# Altium schematic sheet Sheet1.SchDoc
size C; SheetNumber: 1; SheetTotal: 1
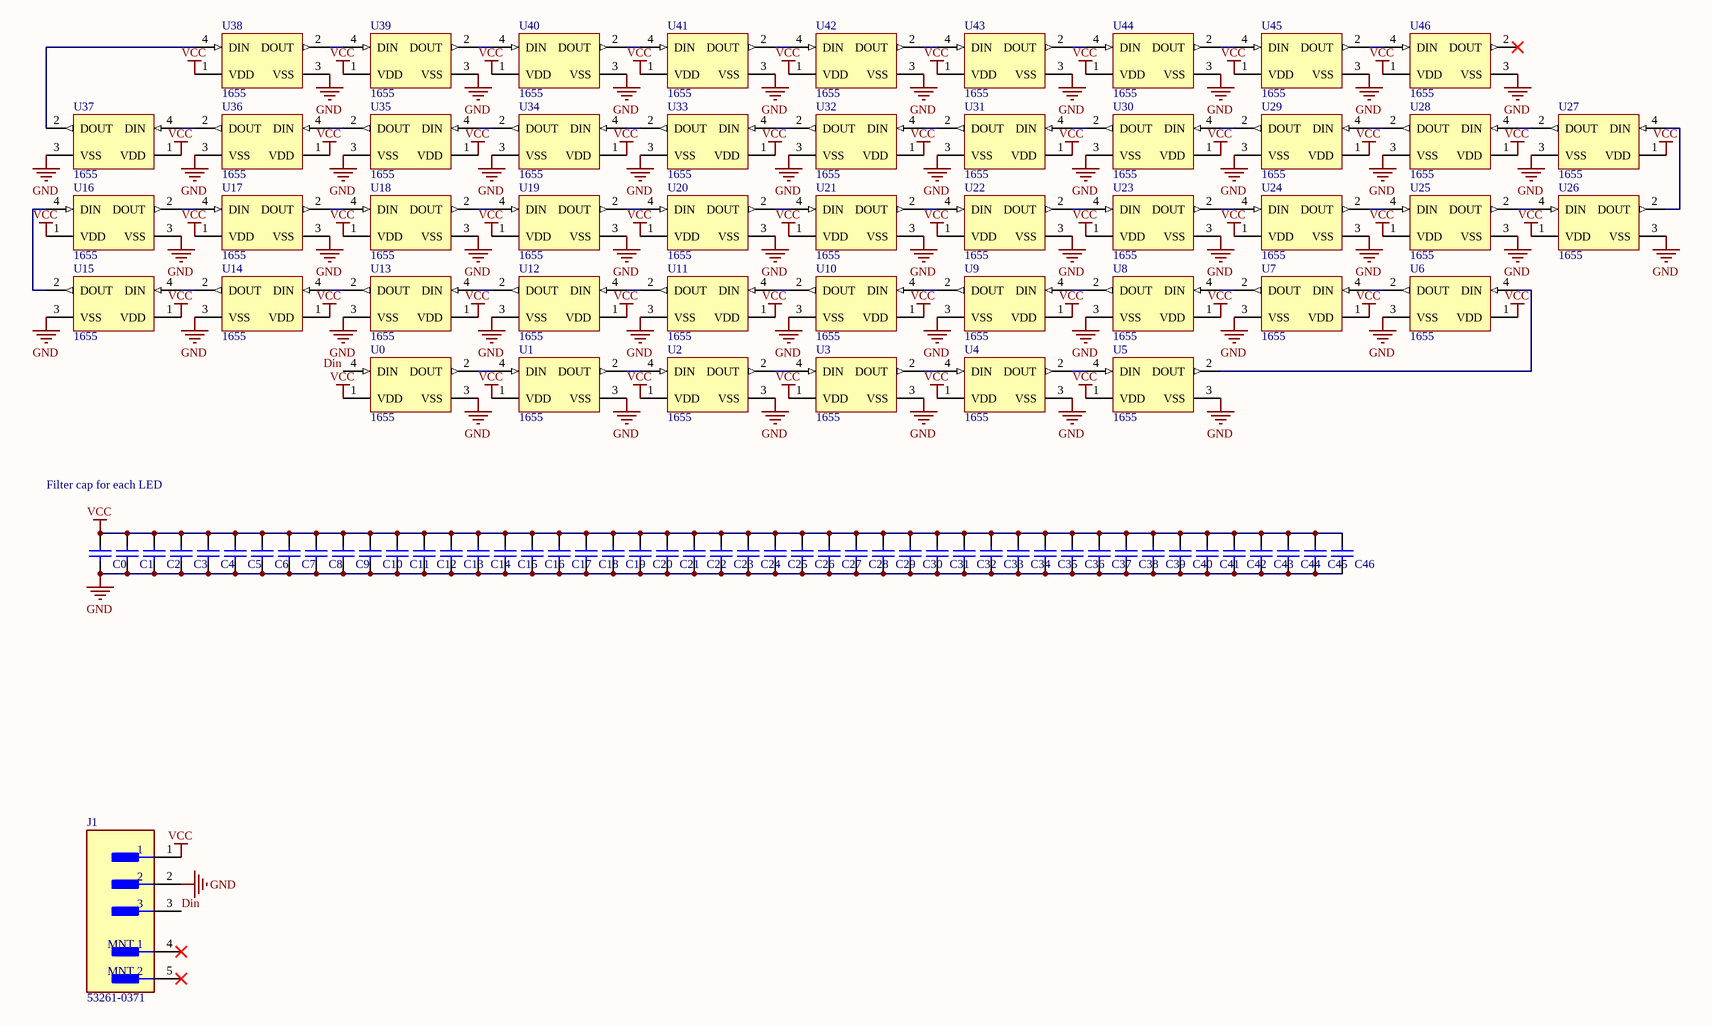
[diagram p0: Sheet1.SchDoc]

## Parts
C0  VJ0603Y104JXJAC  [CAPC1608X92X38LL15T08]  (value not drawn)
C1  VJ0603Y104JXJAC  [CAPC1608X92X38LL15T08]  (value not drawn)
C2  VJ0603Y104JXJAC  [CAPC1608X92X38LL15T08]  (value not drawn)
C3  VJ0603Y104JXJAC  [CAPC1608X92X38LL15T08]  (value not drawn)
C4  VJ0603Y104JXJAC  [CAPC1608X92X38LL15T08]  (value not drawn)
C5  VJ0603Y104JXJAC  [CAPC1608X92X38LL15T08]  (value not drawn)
C6  VJ0603Y104JXJAC  [CAPC1608X92X38LL15T08]  (value not drawn)
C7  VJ0603Y104JXJAC  [CAPC1608X92X38LL15T08]  (value not drawn)
C8  VJ0603Y104JXJAC  [CAPC1608X92X38LL15T08]  (value not drawn)
C9  VJ0603Y104JXJAC  [CAPC1608X92X38LL15T08]  (value not drawn)
C10  VJ0603Y104JXJAC  [CAPC1608X92X38LL15T08]  (value not drawn)
C11  VJ0603Y104JXJAC  [CAPC1608X92X38LL15T08]  (value not drawn)
C12  VJ0603Y104JXJAC  [CAPC1608X92X38LL15T08]  (value not drawn)
C13  VJ0603Y104JXJAC  [CAPC1608X92X38LL15T08]  (value not drawn)
C14  VJ0603Y104JXJAC  [CAPC1608X92X38LL15T08]  (value not drawn)
C15  VJ0603Y104JXJAC  [CAPC1608X92X38LL15T08]  (value not drawn)
C16  VJ0603Y104JXJAC  [CAPC1608X92X38LL15T08]  (value not drawn)
C17  VJ0603Y104JXJAC  [CAPC1608X92X38LL15T08]  (value not drawn)
C18  VJ0603Y104JXJAC  [CAPC1608X92X38LL15T08]  (value not drawn)
C19  VJ0603Y104JXJAC  [CAPC1608X92X38LL15T08]  (value not drawn)
C20  VJ0603Y104JXJAC  [CAPC1608X92X38LL15T08]  (value not drawn)
C21  VJ0603Y104JXJAC  [CAPC1608X92X38LL15T08]  (value not drawn)
C22  VJ0603Y104JXJAC  [CAPC1608X92X38LL15T08]  (value not drawn)
C23  VJ0603Y104JXJAC  [CAPC1608X92X38LL15T08]  (value not drawn)
C24  VJ0603Y104JXJAC  [CAPC1608X92X38LL15T08]  (value not drawn)
C25  VJ0603Y104JXJAC  [CAPC1608X92X38LL15T08]  (value not drawn)
C26  VJ0603Y104JXJAC  [CAPC1608X92X38LL15T08]  (value not drawn)
C27  VJ0603Y104JXJAC  [CAPC1608X92X38LL15T08]  (value not drawn)
C28  VJ0603Y104JXJAC  [CAPC1608X92X38LL15T08]  (value not drawn)
C29  VJ0603Y104JXJAC  [CAPC1608X92X38LL15T08]  (value not drawn)
C30  VJ0603Y104JXJAC  [CAPC1608X92X38LL15T08]  (value not drawn)
C31  VJ0603Y104JXJAC  [CAPC1608X92X38LL15T08]  (value not drawn)
C32  VJ0603Y104JXJAC  [CAPC1608X92X38LL15T08]  (value not drawn)
C33  VJ0603Y104JXJAC  [CAPC1608X92X38LL15T08]  (value not drawn)
C34  VJ0603Y104JXJAC  [CAPC1608X92X38LL15T08]  (value not drawn)
C35  VJ0603Y104JXJAC  [CAPC1608X92X38LL15T08]  (value not drawn)
C36  VJ0603Y104JXJAC  [CAPC1608X92X38LL15T08]  (value not drawn)
C37  VJ0603Y104JXJAC  [CAPC1608X92X38LL15T08]  (value not drawn)
C38  VJ0603Y104JXJAC  [CAPC1608X92X38LL15T08]  (value not drawn)
C39  VJ0603Y104JXJAC  [CAPC1608X92X38LL15T08]  (value not drawn)
C40  VJ0603Y104JXJAC  [CAPC1608X92X38LL15T08]  (value not drawn)
C41  VJ0603Y104JXJAC  [CAPC1608X92X38LL15T08]  (value not drawn)
C42  VJ0603Y104JXJAC  [CAPC1608X92X38LL15T08]  (value not drawn)
C43  VJ0603Y104JXJAC  [CAPC1608X92X38LL15T08]  (value not drawn)
C44  VJ0603Y104JXJAC  [CAPC1608X92X38LL15T08]  (value not drawn)
C45  VJ0603Y104JXJAC  [CAPC1608X92X38LL15T08]  (value not drawn)
C46  VJ0603Y104JXJAC  [CAPC1608X92X38LL15T08]  (value not drawn)
J1  53261-0371  [FP-53261-0371-MFG]
U0  1655  [ADA-RGB-1655_V]
U1  1655  [ADA-RGB-1655_V]
U2  1655  [ADA-RGB-1655_V]
U3  1655  [ADA-RGB-1655_V]
U4  1655  [ADA-RGB-1655_V]
U5  1655  [ADA-RGB-1655_V]
U6  1655  [ADA-RGB-1655_V]
U7  1655  [ADA-RGB-1655_V]
U8  1655  [ADA-RGB-1655_V]
U9  1655  [ADA-RGB-1655_V]
U10  1655  [ADA-RGB-1655_V]
U11  1655  [ADA-RGB-1655_V]
U12  1655  [ADA-RGB-1655_V]
U13  1655  [ADA-RGB-1655_V]
U14  1655  [ADA-RGB-1655_V]
U15  1655  [ADA-RGB-1655_V]
U16  1655  [ADA-RGB-1655_V]
U17  1655  [ADA-RGB-1655_V]
U18  1655  [ADA-RGB-1655_V]
U19  1655  [ADA-RGB-1655_V]
U20  1655  [ADA-RGB-1655_V]
U21  1655  [ADA-RGB-1655_V]
U22  1655  [ADA-RGB-1655_V]
U23  1655  [ADA-RGB-1655_V]
U24  1655  [ADA-RGB-1655_V]
U25  1655  [ADA-RGB-1655_V]
U26  1655  [ADA-RGB-1655_V]
U27  1655  [ADA-RGB-1655_V]
U28  1655  [ADA-RGB-1655_V]
U29  1655  [ADA-RGB-1655_V]
U30  1655  [ADA-RGB-1655_V]
U31  1655  [ADA-RGB-1655_V]
U32  1655  [ADA-RGB-1655_V]
U33  1655  [ADA-RGB-1655_V]
U34  1655  [ADA-RGB-1655_V]
U35  1655  [ADA-RGB-1655_V]
U36  1655  [ADA-RGB-1655_V]
U37  1655  [ADA-RGB-1655_V]
U38  1655  [ADA-RGB-1655_V]
U39  1655  [ADA-RGB-1655_V]
U40  1655  [ADA-RGB-1655_V]
U41  1655  [ADA-RGB-1655_V]
U42  1655  [ADA-RGB-1655_V]
U43  1655  [ADA-RGB-1655_V]
U44  1655  [ADA-RGB-1655_V]
U45  1655  [ADA-RGB-1655_V]
U46  1655  [ADA-RGB-1655_V]

## Nets
GND: C0.2 C1.2 C2.2 C3.2 C4.2 C5.2 C6.2 C7.2 C8.2 C9.2 C10.2 C11.2 C12.2 C13.2 C14.2 C15.2 C16.2 C17.2 C18.2 C19.2 C20.2 C21.2 C22.2 C23.2 C24.2 C25.2 C26.2 C27.2 C28.2 C29.2 C30.2 C31.2 C32.2 C33.2 C34.2 C35.2 C36.2 C37.2 C38.2 C39.2 C40.2 C41.2 C42.2 C43.2 C44.2 C45.2 C46.2 J1.2 U0.3(VSS) U1.3(VSS) U2.3(VSS) U3.3(VSS) U4.3(VSS) U5.3(VSS) U6.3(VSS) U7.3(VSS) U8.3(VSS) U9.3(VSS) U10.3(VSS) U11.3(VSS) U12.3(VSS) U13.3(VSS) U14.3(VSS) U15.3(VSS) U16.3(VSS) U17.3(VSS) U18.3(VSS) U19.3(VSS) U20.3(VSS) U21.3(VSS) U22.3(VSS) U23.3(VSS) U24.3(VSS) U25.3(VSS) U26.3(VSS) U27.3(VSS) U28.3(VSS) U29.3(VSS) U30.3(VSS) U31.3(VSS) U32.3(VSS) U33.3(VSS) U34.3(VSS) U35.3(VSS) U36.3(VSS) U37.3(VSS) U38.3(VSS) U39.3(VSS) U40.3(VSS) U41.3(VSS) U42.3(VSS) U43.3(VSS) U44.3(VSS) U45.3(VSS) U46.3(VSS)
VCC: C0.1 C1.1 C2.1 C3.1 C4.1 C5.1 C6.1 C7.1 C8.1 C9.1 C10.1 C11.1 C12.1 C13.1 C14.1 C15.1 C16.1 C17.1 C18.1 C19.1 C20.1 C21.1 C22.1 C23.1 C24.1 C25.1 C26.1 C27.1 C28.1 C29.1 C30.1 C31.1 C32.1 C33.1 C34.1 C35.1 C36.1 C37.1 C38.1 C39.1 C40.1 C41.1 C42.1 C43.1 C44.1 C45.1 C46.1 J1.1 U0.1(VDD) U1.1(VDD) U2.1(VDD) U3.1(VDD) U4.1(VDD) U5.1(VDD) U6.1(VDD) U7.1(VDD) U8.1(VDD) U9.1(VDD) U10.1(VDD) U11.1(VDD) U12.1(VDD) U13.1(VDD) U14.1(VDD) U15.1(VDD) U16.1(VDD) U17.1(VDD) U18.1(VDD) U19.1(VDD) U20.1(VDD) U21.1(VDD) U22.1(VDD) U23.1(VDD) U24.1(VDD) U25.1(VDD) U26.1(VDD) U27.1(VDD) U28.1(VDD) U29.1(VDD) U30.1(VDD) U31.1(VDD) U32.1(VDD) U33.1(VDD) U34.1(VDD) U35.1(VDD) U36.1(VDD) U37.1(VDD) U38.1(VDD) U39.1(VDD) U40.1(VDD) U41.1(VDD) U42.1(VDD) U43.1(VDD) U44.1(VDD) U45.1(VDD) U46.1(VDD)
Din: J1.3 U0.4(DIN)
NetU0_2: U0.2(DOUT) U1.4(DIN)
NetU1_2: U1.2(DOUT) U2.4(DIN)
NetU2_2: U2.2(DOUT) U3.4(DIN)
NetU3_2: U3.2(DOUT) U4.4(DIN)
NetU4_2: U4.2(DOUT) U5.4(DIN)
NetU5_2: U5.2(DOUT) U6.4(DIN)
NetU6_2: U6.2(DOUT) U7.4(DIN)
NetU7_2: U7.2(DOUT) U8.4(DIN)
NetU8_2: U8.2(DOUT) U9.4(DIN)
NetU9_2: U9.2(DOUT) U10.4(DIN)
NetU10_2: U10.2(DOUT) U11.4(DIN)
NetU11_2: U11.2(DOUT) U12.4(DIN)
NetU12_2: U12.2(DOUT) U13.4(DIN)
NetU13_2: U13.2(DOUT) U14.4(DIN)
NetU14_2: U14.2(DOUT) U15.4(DIN)
NetU15_2: U15.2(DOUT) U16.4(DIN)
NetU16_2: U16.2(DOUT) U17.4(DIN)
NetU17_2: U17.2(DOUT) U18.4(DIN)
NetU18_2: U18.2(DOUT) U19.4(DIN)
NetU19_2: U19.2(DOUT) U20.4(DIN)
NetU20_2: U20.2(DOUT) U21.4(DIN)
NetU21_2: U21.2(DOUT) U22.4(DIN)
NetU22_2: U22.2(DOUT) U23.4(DIN)
NetU23_2: U23.2(DOUT) U24.4(DIN)
NetU24_2: U24.2(DOUT) U25.4(DIN)
NetU25_2: U25.2(DOUT) U26.4(DIN)
NetU26_2: U26.2(DOUT) U27.4(DIN)
NetU27_2: U27.2(DOUT) U28.4(DIN)
NetU28_2: U28.2(DOUT) U29.4(DIN)
NetU29_2: U29.2(DOUT) U30.4(DIN)
NetU30_2: U30.2(DOUT) U31.4(DIN)
NetU31_2: U31.2(DOUT) U32.4(DIN)
NetU32_2: U32.2(DOUT) U33.4(DIN)
NetU33_2: U33.2(DOUT) U34.4(DIN)
NetU34_2: U34.2(DOUT) U35.4(DIN)
NetU35_2: U35.2(DOUT) U36.4(DIN)
NetU36_2: U36.2(DOUT) U37.4(DIN)
NetU37_2: U37.2(DOUT) U38.4(DIN)
NetU38_2: U38.2(DOUT) U39.4(DIN)
NetU39_2: U39.2(DOUT) U40.4(DIN)
NetU40_2: U40.2(DOUT) U41.4(DIN)
NetU41_2: U41.2(DOUT) U42.4(DIN)
NetU42_2: U42.2(DOUT) U43.4(DIN)
NetU43_2: U43.2(DOUT) U44.4(DIN)
NetU44_2: U44.2(DOUT) U45.4(DIN)
NetU45_2: U45.2(DOUT) U46.4(DIN)

Not connected (* = marked no-connect by the designer): J1 4(MNT_1)* 5(MNT_2)*; U46 2(DOUT)*

## Notes on the sheet
- Filter cap for each LED

## Library data of the parts
C0-C46 = CMP-1035-02583-2: Manufacturer: Vitramon; Part Number: VJ0603Y104JXJAC
J1 = CMP-04776-000071-1: CONN HEADER SMD R/A 3POS 1.25MM; Manufacturer: Molex; Number Of Contacts: 3; Conn Orientation: Right Angle; Current Rating: 1A; Description: Wire-To-Board Connector, Right Angle, 1.25 mm, 3 Contacts, Header, PicoBlade 53261 Series; Voltage Rating: 125V; Conn Gender: Male; Category: Conn; Automotive: No; Footprint Url: https://www.molex.com/pdm_docs/sd/532610371_sd.pdf; Height: 3.6mm; Number Of Rows: 1; Temperature Range Low: -40°C; Package: 0; Octopart: https://octopart.com/53261-0371-molex-655314; ComponentLink2Description: Datasheet; Lead Free: Yes; Ambient Temperature Range Low: -40°C; Device Class L3: unset; Mouser Description: 1.25mm (.049") Pitch PicoBlade Header, Surface Mount, Right Angle, Lead-free, 3 Circuits; Digikey Description: CONN HEADER SMD R/A 3POS 1.25MM; Device Class L2: Headers and Wire Housings; Contact Material: Tin,Nickel; Manufacturer Part Number: 53261-0371; Ambient Temperature Range High: +105°C; ComponentLink2URL: https://www.molex.com/webdocs/datasheets/pdf/en-us/0532610371_PCB_HEADERS.pdf; Pitch: 1.25mm; Temperature: -40°C to +105°C; RoHS: TRUE; Device Class L1: Connectors; Temperature Range High: +105°C
U0-U46 = CMP-2000-05026-1: Intelligent Control LED Integrated Light Source, 3.5 to 5.3 V, -25 to 80 degC, 4-Pin SMD, RoHS, Tape and Reel; Manufacturer: Adafruit-Industries-LLC; Number of LEDs: 10; Configuration: Discrete; Utilized LED: WS2812(5050); Datasheet URL: http://datasheet.octopart.com/ADA1655-Adafruit-Industries-datasheet-32028139.pdf; Series: Neopixel; Interface: -; Package Description: 4-Pin Surface Mount Device, Body 5 x 5 mm; Color: Red,Green,Blue(RGB); Category: Optoelectronics; Controller Type: -; Package Reference: 1655; Manufacturer URL: https://www.adafruit.com/; Mounting Type: SurfaceMount; Datasheet Version: May-13; Size / Dimension: 5.00mmLx5.00mmW; Family: Addressable,Specialty